# EAGLE design powerreducer (EAGLE 9.6.2)
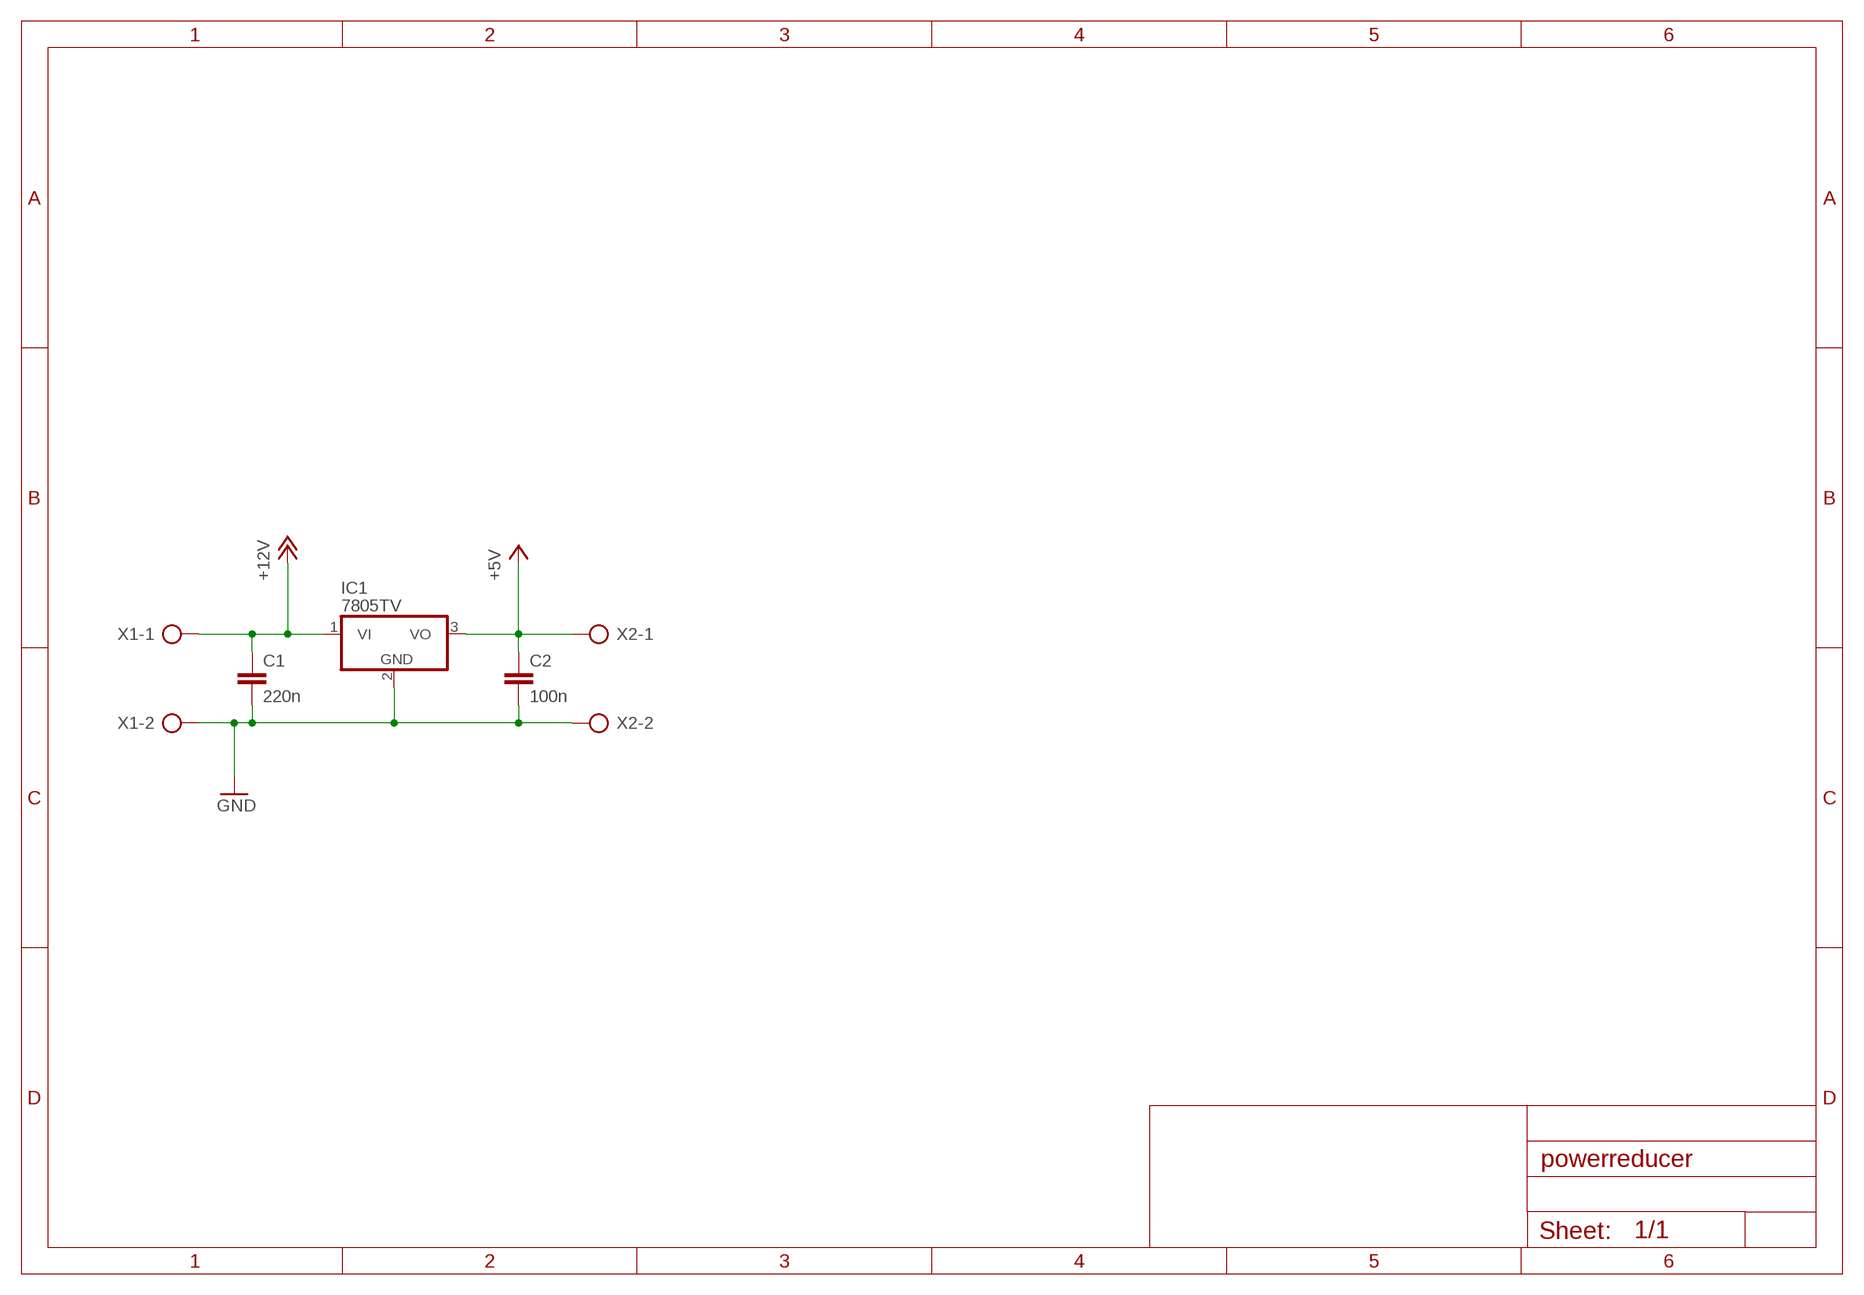
[diagram p0: schematic, sheet 1]

## Parts
C1  220n  C-EU050-025X075  [C050-025X075]
C2  100n  C-EU050-025X075  [C050-025X075]
IC1  7805TV  [TO220V]
X1  AK300/2  [AK300/2]
X2  AK300/2  [AK300/2]

## Nets
+5V: C2.1 IC1.3(VO) X2.1
+12V: C1.1 IC1.1(VI) X1.1
GND: C1.2 C2.2 IC1.2(GND) X1.2 X2.2

## Library data of the parts
C1 C2 = rcl:C-EU: CAPACITOR, European symbol; SPICEPREFIX: C
IC1 = linear:78*: Positive VOLTAGE REGULATOR Source: http://cache.national.com/ds/LM/LM78L05.pdf http://www.fairchildsemi.com/ds/LM/LM7805.pdf
X1 X2 = con-ptr500:AK300/2: CONNECTOR; OC_FARNELL: unknown; OC_NEWARK: unknown

## Board
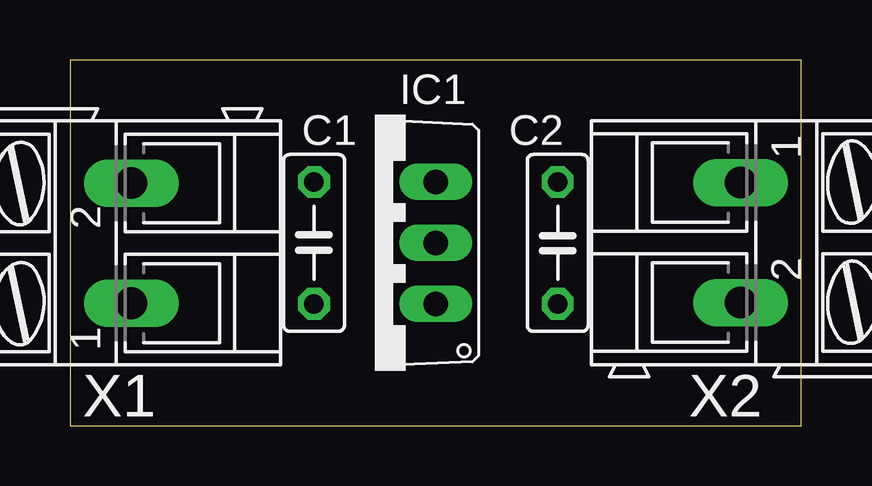
[diagram p1: board, top side]
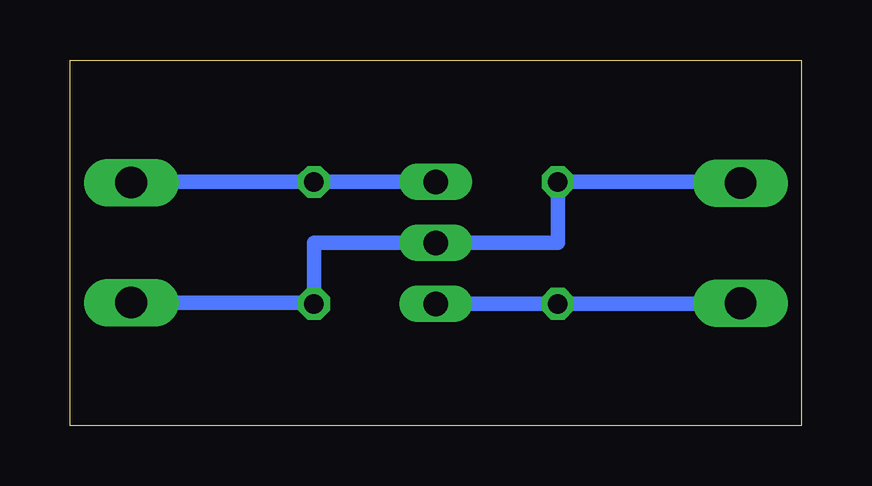
[diagram p2: board, bottom side, seen from below]

Size 30.48 x 15.24 mm. Coordinates in mm from the lower left corner, seen from the top.
Outline: 0,0 30.48,0 30.48,15.24 0,15.23 0,0
Copper layers (1*16): Top 0.035mm / dielectric 1.5mm / Bottom 0.035mm
Design rules "default": minimum track width 6mil, minimum drill 0.35mm, track to track 6mil, track to pad 6mil, pad to pad 6mil, via to via 6mil, smd to smd 6mil, copper to edge 40mil, drill to drill 6mil, minimum pad ring 10mil, minimum via ring 8mil, stop-mask expansion 4mil, vias tented up to drill 0mil, thermal gap 10mil

### Footprints (pad centres in the part's own frame; a part is rotated, then mirrored left to right if it is on the bottom)
C050-025X075 = drill 0.813 octagon: 1 -2.54,0; 2 2.54,0
TO220V = drill 1.016 long: 1 -2.54,-2.54; 2 0,-2.54; 3 2.54,-2.54
AK300/2 = drill 1.321 long: 1 -2.515,0; 2 2.489,0

### Placement (x,y rotation side)
C1  10.16,7.62 90 top
C2  20.32,7.62 270 top
IC1  12.7,7.62 90 top
X1  2.54,7.62 90 top
X2  27.94,7.62 270 top

### Tracks (layer width: path | path; a pad name or v marks a point on that pad's centre or on a via)
+5V
  Bottom 0.61: IC1.3 C2.1 27.91,10.16 X2.1
+12V
  Bottom 0.61: IC1.1 C1.1 2.56,5.08 X1.1
GND
  Bottom 0.61: X1.2 2.59,10.16 C1.2 10.16,7.62 IC1.2 20.32,7.62 C2.2 20.37,5.13 X2.2